# EAGLE design untitled (EAGLE 9.6.2)
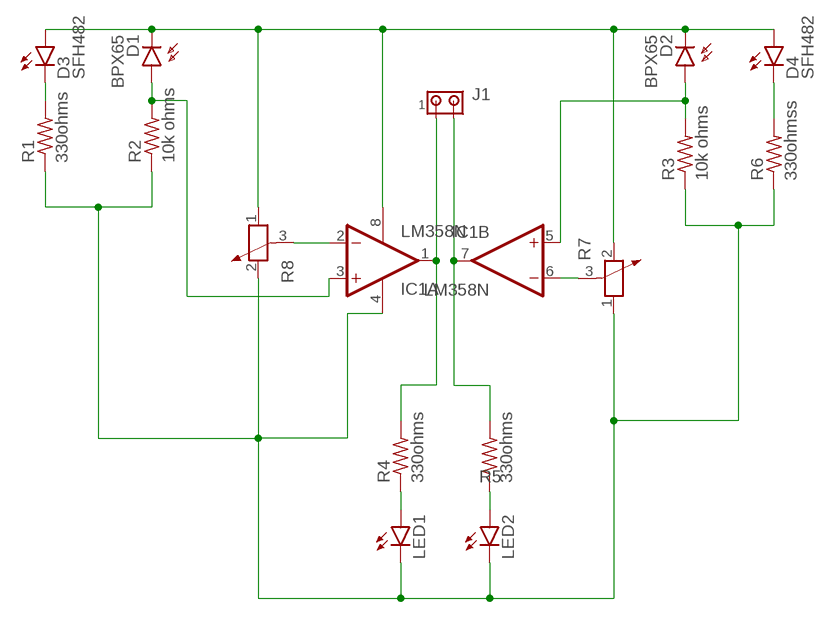
[diagram p0: schematic, sheet 1]

## Parts
D1  BPX65  [BPX65]
D2  BPX65  [BPX65]
D3  SFH482  [SFH482]
D4  SFH482  [SFH482]
IC1  LM358N  [DIL08]
J1  MTA02-100  [10X02MTA]
LED1  LED3MM  [LED3MM]
LED2  LED3MM  [LED3MM]
R1  330ohms  R-US_0204/5  [0204/5]
R2  10k ohms  R-US_0204/5  [0204/5]
R3  10k ohms  R-US_0204/5  [0204/5]
R4  330ohms  R-US_0204/5  [0204/5]
R5  330ohms  R-US_0204/5  [0204/5]
R6  330ohmss  R-US_0204/5  [0204/5]
R7  POTENTIOMETER_PT-10  [PT-10]
R8  POTENTIOMETER_PT-10  [PT-10]

## Nets
N$1: IC1.2(A:-IN) R8.3
N$2: D1.K(C) D2.K(C) D3.A D4.A IC1.8(P:V+) R7.2 R8.1
N$3: D3.K(C) R1.2
N$4: D2.A IC1.5(B:+IN) R3.2
N$5: D1.A IC1.3(A:+IN) R2.2
N$6: IC1.1(A:OUT) J1.1 R4.2
N$7: IC1.7(B:OUT) J1.2 R5.2
N$8: IC1.6(B:-IN) R7.3
N$10: D4.K(C) R6.2
N$12: LED1.A R4.1
N$13: LED2.A R5.1
N$14: IC1.4(P:V-) LED1.K(C) LED2.K(C) R1.1 R2.1 R3.1 R6.1 R7.1 R8.2

## Library data of the parts
D1 D2 = opto-trans-siemens:BPX65: PHOTO DIODE; MPN: BPX65.; OC_FARNELL: 327451; OC_NEWARK: 06WX2764
D3 D4 = led:SFH482: IR LED infrared emitting diode, Infineon
IC1 = linear:LM358: OP AMP also LM158; LM258; LM2904 Source: http://cache.national.com/ds/LM/LM158.pdf
J1 = con-amp:MTA02-100: AMP connector
LED1 LED2 = led:LED: LED OSRAM: - CHIPLED LG R971, LG N971, LY N971, LG Q971, LY Q971, LO R971, LY R971 LH N974, LH R974 LS Q976, LO Q976, LY Q976 LO Q996 - Hyper CHIPLED LW Q18S LB Q993, LB Q99A, LB R99A - SideLED LS A670, LO A670, LY A670, LG A670, LP A670 LB A673, LV A673, LT A673, LW A673 LH A674 LY A675 LS A676, LA A676, LO A676, LY A676, LW A676 LS A679, LY A679, LG A679 - Hyper Micro SIDELED® LS Y876, LA Y876, LO Y876, LY Y876 LT Y87S - SmartLED LW L88C, LW L88S LB L89C, LB L89S, LG L890 LS L89K, LO L89K, LY L89K LS L896, LA L896, LO L896, LY L896 - TOPLED LS T670, LO T670, LY T670, LG T670, LP T670 LSG T670, LSP T670, LSY T670, LOP T670, LYG T670 LG T671, LOG T671, LSG T671 LB T673, LV T673, LT T673, LW T673 LH T674 LS T676, LA T676, LO T676, LY T676, LB T676, LH T676, LSB T676, LW T676 LB T67C, LV T67C, LT T67C, LS T67K, LO T67K, LY T67K, LW E67C LS E67B, LA E67B, LO E67B, LY E67B, LB E67C, LV E67C, LT E67C LW T67C LS T679, LY T679, LG T679 LS T770, LO T770, LY T770, LG T770, LP T770 LB T773, LV T773, LT T773, LW T773 LH T774 LS E675, LA E675, LY E675, LS T675 LS T776, LA T776, LO T776, LY T776, LB T776 LHGB T686 LT T68C, LB T68C - Hyper Mini TOPLED® LB M676 - Mini TOPLED Santana® LG M470 LS M47K, LO M47K, LY M47K Source: http://www.osram.convergy.de LUXEON: - LUMILED® LXK2-PW12-R00, LXK2-PW12-S00, LXK2-PW14-U00, LXK2-PW14-V00 LXK2-PM12-R00, LXK2-PM12-S00, LXK2-PM14-U00 LXK2-PE12-Q00, LXK2-PE12-R00, LXK2-PE12-S00, LXK2-PE14-T00, LXK2-PE14-U00 LXK2-PB12-K00, LXK2-PB12-L00, LXK2-PB12-M00, LXK2-PB14-N00, LXK2-PB14-P00, LXK2-PB14-Q00 LXK2-PR12-L00, LXK2-PR12-M00, LXK2-PR14-Q00, LXK2-PR14-R00 LXK2-PD12-Q00, LXK2-PD12-R00, LXK2-PD12-S00 LXK2-PH12-R00, LXK2-PH12-S00 LXK2-PL12-P00, LXK2-PL12-Q00, LXK2-PL12-R00 Source: www.luxeon.com KINGBRIGHT: KA-3528ASYC Source: www.kingbright.com
R1-R6 = rcl:R-US_: RESISTOR, American symbol; SPICEPREFIX: R
R7 R8 = rcl:POTENTIOMETER_: Potentiometer; SPICEMODEL: POT; SPICEPREFIX: X

## Board
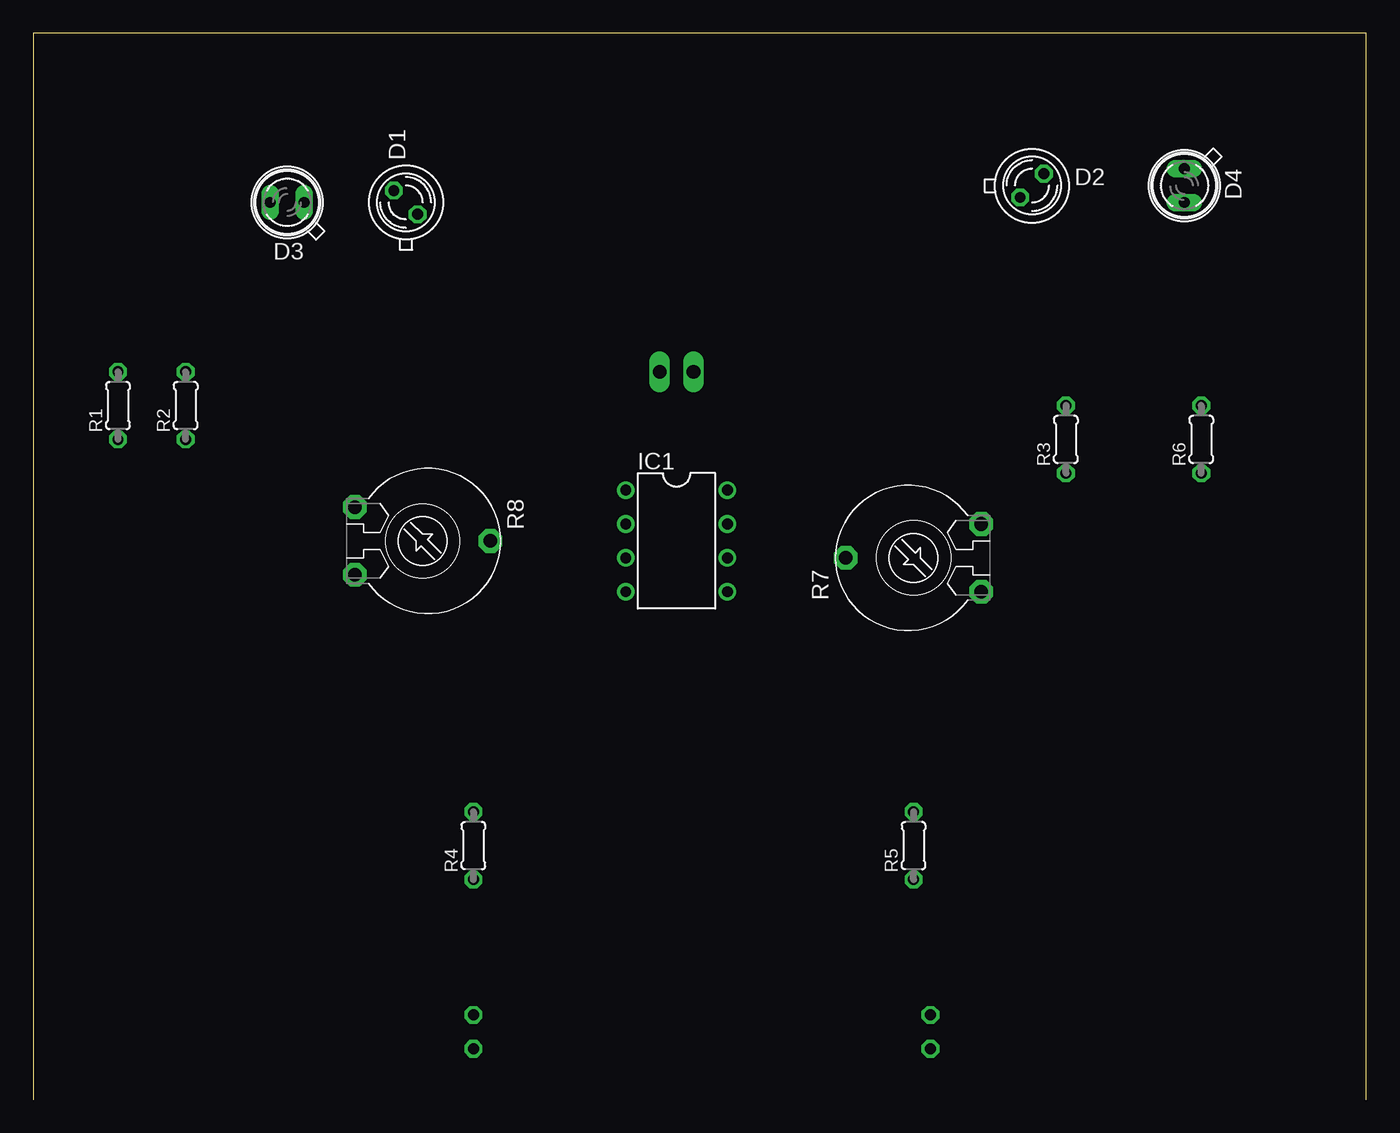
[diagram p1: board, top side]
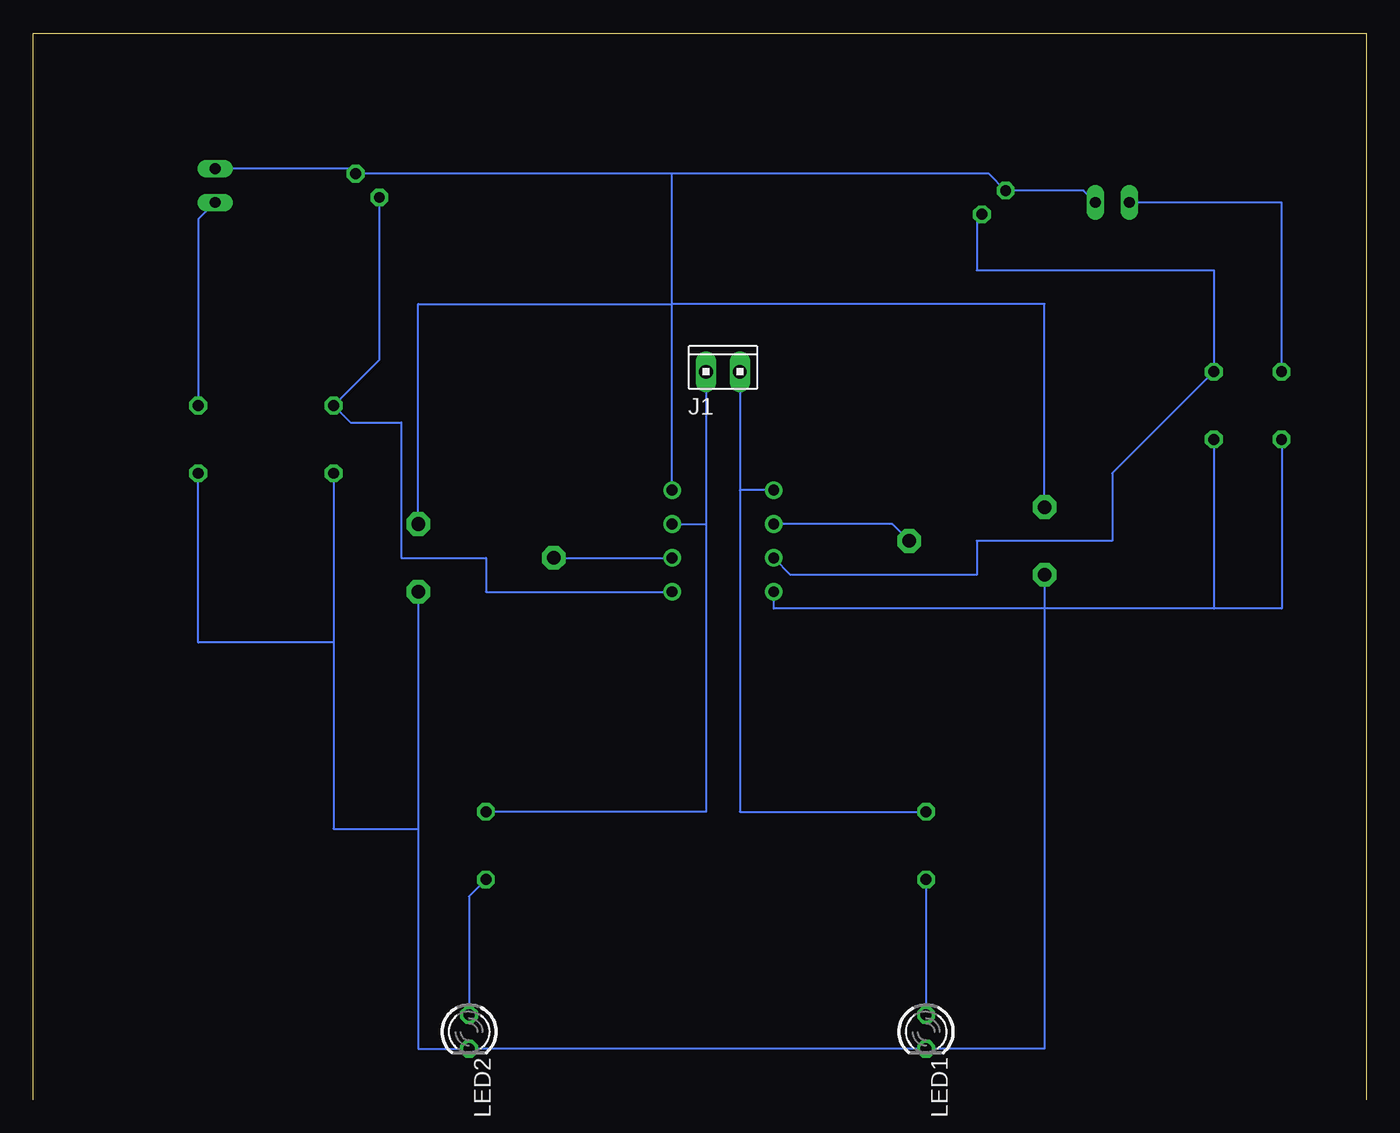
[diagram p2: board, bottom side, seen from below]

Size 100 x 80 mm. Coordinates in mm from the lower left corner, seen from the top.
Outline: 100,0 100,80 0,80 0,0
Copper layers (1*16): Top 0.035mm / dielectric 1.5mm / Bottom 0.035mm
Design rules "default": minimum track width 6mil, minimum drill 0.35mm, track to track 6mil, track to pad 6mil, pad to pad 6mil, via to via 6mil, smd to smd 6mil, copper to edge 40mil, drill to drill 6mil, minimum pad ring 10mil, minimum via ring 8mil, stop-mask expansion 4mil, vias tented up to drill 0mil, thermal gap 10mil

### Footprints (pad centres in the part's own frame; a part is rotated, then mirrored left to right if it is on the bottom)
BPX65 = drill 0.813 octagon: A -0.889,-0.889; K 0.889,0.889
SFH482 = drill 0.813 long: A -1.27,0; K 1.27,0
DIL08 = drill 0.813 pad 1.27: 1 -3.81,-3.81; 2 -1.27,-3.81; 3 1.27,-3.81; 4 3.81,-3.81; 5 3.81,3.81; 6 1.27,3.81; 7 -1.27,3.81; 8 -3.81,3.81
10X02MTA = drill 1.016 long: 1 1.27,0; 2 -1.27,0
LED3MM = drill 0.813 octagon: A -1.27,0; K 1.27,0
0204/5 = drill 0.813 octagon: 1 -2.54,0; 2 2.54,0
PT-10 = drill 1.016 pad 1.778 octagon: 1 -2.54,-5.08; 2 2.54,-5.08; 3 0,5.08

### Placement (x,y rotation side)
D1  27.94,67.31 90 top
D2  74.93,68.58 0 top
D3  19.05,67.31 180 top
D4  86.36,68.58 270 top
IC1  48.26,41.91 270 top
J1  48.26,54.61 0 bottom
LED1  33.02,5.08 270 bottom
LED2  67.31,5.08 270 bottom
R1  6.35,52.07 90 top
R2  11.43,52.07 90 top
R3  77.47,49.53 90 top
R4  33.02,19.05 90 top
R5  66.04,19.05 90 top
R6  87.63,49.53 90 top
R7  66.04,40.64 90 top
R8  29.21,41.91 270 top

### Tracks (layer width: path | path; a pad name or v marks a point on that pad's centre or on a via)
N$1
  Bottom 0.152: R8.3 35.56,43.18 IC1.2
N$2
  Bottom 0.152: D3.A 21.21,68.2 D1.K 28.32,69.47 52.07,69.47 | D4.A 76.2,69.85 D2.K 52.07,69.47 | R8.1 24.13,59.69 52.07,59.69 | IC1.8 52.07,59.69 | 52.07,59.69 52.07,69.47 | R7.2 71.12,59.69 52.07,59.69
N$3
  Bottom 0.152: R1.2 6.35,67.31 D3.K
N$4
  Bottom 0.152: D2.A 74.04,55.5 R3.2 76.2,50.8 72.39,50.8 72.39,40.64 66.04,40.64 66.04,38.1 IC1.5
N$5
  Bottom 0.152: IC1.3 43.18,39.37 29.21,39.37 29.21,41.91 19.05,41.91 19.05,46.99 R2.2 11.43,62.23 29.21,62.23 29.21,66.04 D1.A
N$6
  Bottom 0.152: J1.1 46.99,45.72 | 46.99,45.72 46.99,21.59 R4.2 | IC1.1 46.99,45.72
N$7
  Bottom 0.152: J1.2 49.53,43.18 | 49.53,43.18 49.53,21.59 R5.2 | IC1.7 49.53,43.18
N$8
  Bottom 0.152: R7.3 IC1.6
N$10
  Bottom 0.152: D4.K 87.63,66.04 R6.2
N$12
  Bottom 0.152: R4.1 LED1.A
N$13
  Bottom 0.152: R5.1 67.31,15.24 LED2.A
N$14
  Bottom 0.152: R1.1 6.35,36.83 11.43,36.83 | 11.43,36.83 24.13,36.83 | 24.13,36.83 44.45,36.83 IC1.4 | 24.13,36.83 24.13,3.81 LED1.K LED2.K 71.12,3.81 71.12,20.32 | R8.2 24.13,36.83 | R2.1 11.43,36.83 | R7.1 71.12,20.32 | R3.1 77.47,34.29 | R6.1 87.63,34.29 77.47,34.29 | 77.47,34.29 77.47,20.32 71.12,20.32